# EAGLE schematic ATmega328P_SMD_603 (EAGLE 7.5.0)
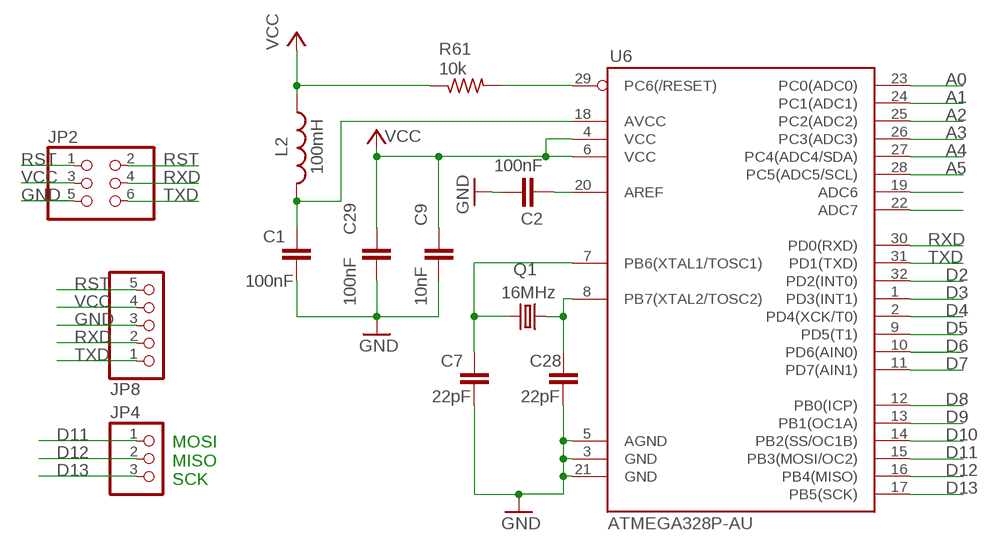
[diagram p0: schematic, sheet 1]

## Parts
C1  100nF  C-EUC0603  [C0603]
C2  100nF  C-EUC0603  [C0603]
C7  22pF  C-EUC0603  [C0603]
C9  10nF  C-EUC0603  [C0603]
C28  22pF  C-EUC0603  [C0603]
C29  100nF  C-EUC0603  [C0603]
JP2  PINHD-2X3  [2X03]
JP4  PINHD-1X3  [1X03]
JP8  PINHD-1X5/90  [1X05/90]
L2  100mH  L-USL0603  [L0603]
Q1  16MHz  KX-7  [3.2X2.5_KX-7]
R61  10k  R-US_R0603  [R0603]
U6  ATMEGA328P-AU  ATMEGA168  [TQFP32-08]

## Nets
D11: JP4.1
D12: JP4.2
D13: JP4.3
GND: C1.2 C2.2 C7.2 C9.2 C28.2 C29.2 JP2.5 JP8.3 U6.3(GND) U6.5(AGND) U6.21(GND)
N$1: C2.1 U6.20(AREF)
N$2: C28.1 Q1.1 U6.8(PB7(XTAL2/TOSC2))
N$3: C7.1 Q1.3 U6.7(PB6(XTAL1/TOSC1))
N$5: C1.1 L2.2 U6.18(AVCC)
RESET: R61.2 U6.29(PC6(/RESET))
RST: JP2.1 JP2.2 JP8.5
RXD: JP2.4 JP8.2
TXD: JP2.6 JP8.1
VCC: C9.1 C29.1 JP2.3 JP8.4 L2.1 R61.1 U6.4(VCC) U6.6(VCC)
Unconnected: U6.1(PD3(INT1)) U6.2(PD4(XCK/T0)) U6.9(PD5(T1)) U6.10(PD6(AIN0)) U6.11(PD7(AIN1)) U6.12(PB0(ICP)) U6.13(PB1(OC1A)) U6.14(PB2(SS/OC1B)) U6.15(PB3(MOSI/OC2)) U6.16(PB4(MISO)) U6.17(PB5(SCK)) U6.19(ADC6) U6.22(ADC7) U6.23(PC0(ADC0)) U6.24(PC1(ADC1)) U6.25(PC2(ADC2)) U6.26(PC3(ADC3)) U6.27(PC4(ADC4/SDA)) U6.28(PC5(ADC5/SCL)) U6.30(PD0(RXD)) U6.31(PD1(TXD)) U6.32(PD2(INT0))

## Notes on the sheet
- MOSI
  MISO
  SCK

## Library data of the parts
C1 C2 C7 C9 C28 C29 = rcl:C-EU: CAPACITOR, European symbol; SPICEPREFIX: C
JP2 = pinhead:PINHD-2X3: PIN HEADER
JP4 = adafruit:PINHD-1X3: PIN HEADER
JP8 = pinhead:PINHD-1X5: PIN HEADER
L2 = rcl-2:L-US: INDUCTOR, American symbol
Q1 = crystal-geyer_V1_0:KX: Quartz Crystals (MHz) SMD: KX - Serie Model Size l/w/h [mm] Frequency Range Frequency Stability Temp. Range [°C] Load Capacitance AECQ 200 availabel Datasheet KX-4 KX-5 KX-6 KX-7 KX-9A KX-9B KX-12A KX-12B KX-13 KX-20 KX-K KX-KS 1.6/1.2/0.3 2.0/1.6/0.45 2.5/2.0/0.55 3.2/2.5/0.8 5.0/3.2/1.0 5.0/3.2/1.1 6.0/3.5/1.1 6.0/3.5/1.0 7.0/5.0 /1.3 11.6/5.5/1.6 12.3/4.5/4.2 12.3/4.5/3.2 24.0 ~ 80.0 MHz 16.0 ~ 80.0 MHz 12.0 ~ 80.0 MHz 8.0 ~ 60.0 MHz 7,68 ~ 300,0 MHz 8,0 ~ 50,0 MHz 8,0 ~ 150,0 MHz 8,0 ~ 50,0 MHz 6,0 ~ 160,0 MHz 3,579 ~ 25,0 MHz 3,579 ~ 70,0 MHz 3,579 ~ 70,0 MHz ±10 … ±50ppm ±10 … ±50ppm ±10 … ±50ppm ±10 … ±50ppm ±10 … ±50ppm ±10 … ±50ppm ±10 … ±50ppm ±10 … ±50ppm ±10 … ±50ppm ±50ppm ±10 … ±50ppm ±10 … ±50ppm (*) -40°C …+85°C (*) -40°C …+125°C (*) -40°C …+125°C (*) -40°C …+125°C (*) -40°C …+105°C (*) -40°C …+105°C (*) -40°C …+125°C (*) -40°C …+105°C (*) -40°C …+105°C (*) -40°C …+105°C (*) -40°C …+85°C (*) -40°C …+85°C 8, 8…16 8, 8…16 10, 8…16 12, 7…20 16, 10…20 16, 10…20 16, 10…20 16, 12…20 16, 12…20 16, 12…20 16, 12…30 16, 12…30 - yes yes yes - - - - - - - - KX-4.pdf <http://www.geyer-electronic.de/uploads/tx_userartikelfrequenz/GEYER-KX-4.pdf> KX-5.pdf <http://www.geyer-electronic.de/uploads/tx_userartikelfrequenz/GEYER-KX-5.pdf> KX-6.pdf <http://www.geyer-electronic.de/uploads/tx_userartikelfrequenz/GEYER-KX-6.pdf> KX-7.pdf <http://www.geyer-electronic.de/uploads/tx_userartikelfrequenz/GEYER-KX-7.pdf> KX-9A.pdf <http://www.geyer-electronic.de/uploads/tx_userartikelfrequenz/GEYER-KX-9A.pdf> KX-9B.pdf <http://www.geyer-electronic.de/uploads/tx_userartikelfrequenz/GEYER-KX-9B.pdf> KX-12A.pdf <http://www.geyer-electronic.de/uploads/tx_userartikelfrequenz/GEYER-KX-12A.pdf> KX-12B.pdf <http://www.geyer-electronic.de/uploads/tx_userartikelfrequenz/GEYER-KX-12B.pdf> KX-13.pdf <http://www.geyer-electronic.de/uploads/tx_userartikelfrequenz/GEYER-KX-13.pdf> KX-20.pdf <http://www.geyer-electronic.de/uploads/tx_userartikelfrequenz/GEYER-KX-20.pdf> KX-K.pdf <http://www.geyer-electronic.de/uploads/tx_userartikelfrequenz/GEYER-KX-K.pdf> KX-KS.pdf <http://www.geyer-electronic.de/uploads/tx_userartikelfrequenz/GEYER-KX-KS.pdf> <http://www.geyer-electronic.de/fileadmin/template/img/logo-geyer-electronic.png> Details see: http://www.geyer-electronic.de/Frequenz-Produkte.9.0.html Created 2016-06-07, Hans Locher 2016 (C) Geyer Quartz Technology KX4,KX5,KX6,KX7,KX9A,KX9B,KX12A,KX12B,KX13,KX20,KXK,KXKS;1612;2016;2520;3225;5032;6035;7050;11655;12345;1,6x1,2;2,0x1,6;2,5x2,0;3,2x2,5;5,0x3,2;6,0x3,5;7,0x5,0;11,6x5,5;12,3x4,5;12,3x4,5;1.6x1.2;2.0x1.6;2.5x2.0;3.2x2.5;5.0x3.2;6.0x3.5;7.0x5.0;11.6x5.5;12.3x4.5;12.3x4.5;
R61 = rcl-2:R-US_: RESISTOR, American symbol
U6 = SparkFun:ATMEGA168